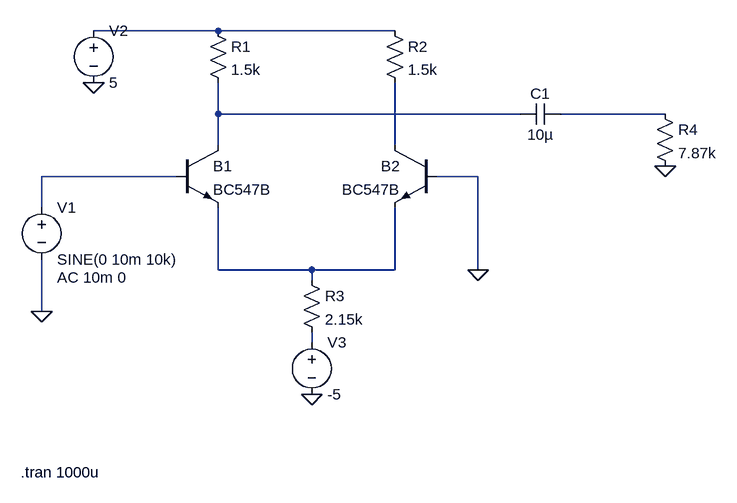
[diagram p0: schematic Pre_amp.asc]
Pre_amp.asc, the LTspice schematic file:
Version 4.1
SHEET 1 5036 884
WIRE -16 112 -208 112
WIRE 256 112 -16 112
WIRE -16 240 -16 192
WIRE 448 240 -16 240
WIRE 672 240 512 240
WIRE -16 288 -16 240
WIRE 256 288 256 192
WIRE -80 336 -288 336
WIRE 384 336 320 336
WIRE -288 384 -288 336
WIRE -16 480 -16 384
WIRE 128 480 -16 480
WIRE 256 480 256 384
WIRE 256 480 128 480
WIRE 384 480 384 336
WIRE 128 496 128 480
WIRE -288 544 -288 464
WIRE 128 592 128 576
FLAG -208 192 0
FLAG 128 672 0
FLAG 384 480 0
FLAG -288 544 0
FLAG 672 320 0
SYMBOL npn -80 288 R0
SYMATTR InstName B1
SYMATTR Value BC547B
SYMBOL npn 320 288 M0
SYMATTR InstName B2
SYMATTR Value BC547B
SYMBOL res -32 96 R0
SYMATTR InstName R1
SYMATTR Value 1.5k
SYMBOL res 240 96 R0
SYMATTR InstName R2
SYMATTR Value 1.5k
SYMBOL res 112 480 R0
SYMATTR InstName R3
SYMATTR Value 2.15k
SYMBOL voltage -208 96 R0
WINDOW 123 0 0 Left 0
WINDOW 39 0 0 Left 0
SYMATTR InstName V2
SYMATTR Value 5
SYMBOL voltage 128 576 R0
WINDOW 123 0 0 Left 0
WINDOW 39 0 0 Left 0
SYMATTR InstName V3
SYMATTR Value -5
SYMBOL voltage -288 368 R0
WINDOW 123 24 124 Left 2
WINDOW 39 0 0 Left 0
SYMATTR Value2 AC 10m 0
SYMATTR InstName V1
SYMATTR Value SINE(0 10m 10k)
SYMBOL cap 512 224 R90
WINDOW 0 0 32 VBottom 2
WINDOW 3 32 32 VTop 2
SYMATTR InstName C1
SYMATTR Value 10µ
SYMBOL res 656 224 R0
SYMATTR InstName R4
SYMATTR Value 7.87k
TEXT -320 792 Left 2 !.tran 1000u

The netlist it stands for:
* Pre_amp.asc
Q§B1 N002 N005 N006 0 BC547B
Q§B2 N004 0 N006 0 BC547B
R1 N001 N002 1.5k
R2 N001 N004 1.5k
R3 N006 N007 2.15k
V2 N001 0 5
V3 N007 0 -5
V1 N005 0 SINE(0 10m 10k) AC 10m 0
C1 N003 N002 10µ
R4 N003 0 7.87k
.model NPN NPN
.model PNP PNP
.lib standard.bjt
.tran 1000u
.backanno
.end